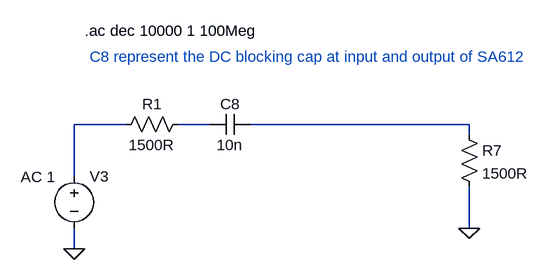
[diagram p0: schematic SA612 Bypass Cap Test.asc]
SA612 Bypass Cap Test.asc, the LTspice schematic file:
Version 4
SHEET 1 1176 1300
WIRE -624 208 -704 208
WIRE -496 208 -544 208
WIRE -96 208 -432 208
WIRE -96 224 -96 208
WIRE -704 288 -704 208
WIRE -96 368 -96 304
WIRE -704 400 -704 368
FLAG -704 400 0
FLAG -96 368 0
SYMBOL voltage -704 272 R0
WINDOW 3 -50 77 Left 2
WINDOW 123 -82 17 Left 2
WINDOW 39 0 0 Left 2
SYMATTR Value ""
SYMATTR Value2 AC 1
SYMATTR InstName V3
SYMBOL cap -432 192 R90
WINDOW 0 0 32 VBottom 2
WINDOW 3 32 32 VTop 2
SYMATTR InstName C8
SYMATTR Value 10n
SYMBOL res -112 208 R0
SYMATTR InstName R7
SYMATTR Value 1500R
SYMBOL res -528 192 R90
WINDOW 0 0 56 VBottom 2
WINDOW 3 32 56 VTop 2
SYMATTR InstName R1
SYMATTR Value 1500R
TEXT -688 64 Left 2 !.ac dec 10000 1 100Meg
TEXT -680 104 Left 2 ;C8 represent the DC blocking cap at input and output of SA612

The netlist it stands for:
* SA612 Bypass Cap Test.asc
V3 N001 0 AC 1
C8 N003 N002 10n
R7 N003 0 1500R
R1 N002 N001 1500R
.ac dec 10000 1 100Meg
* C8 represent the DC blocking cap at input and output of SA612
.backanno
.end